# EAGLE design TZATZIKI_v8 (EAGLE 7.6.0)
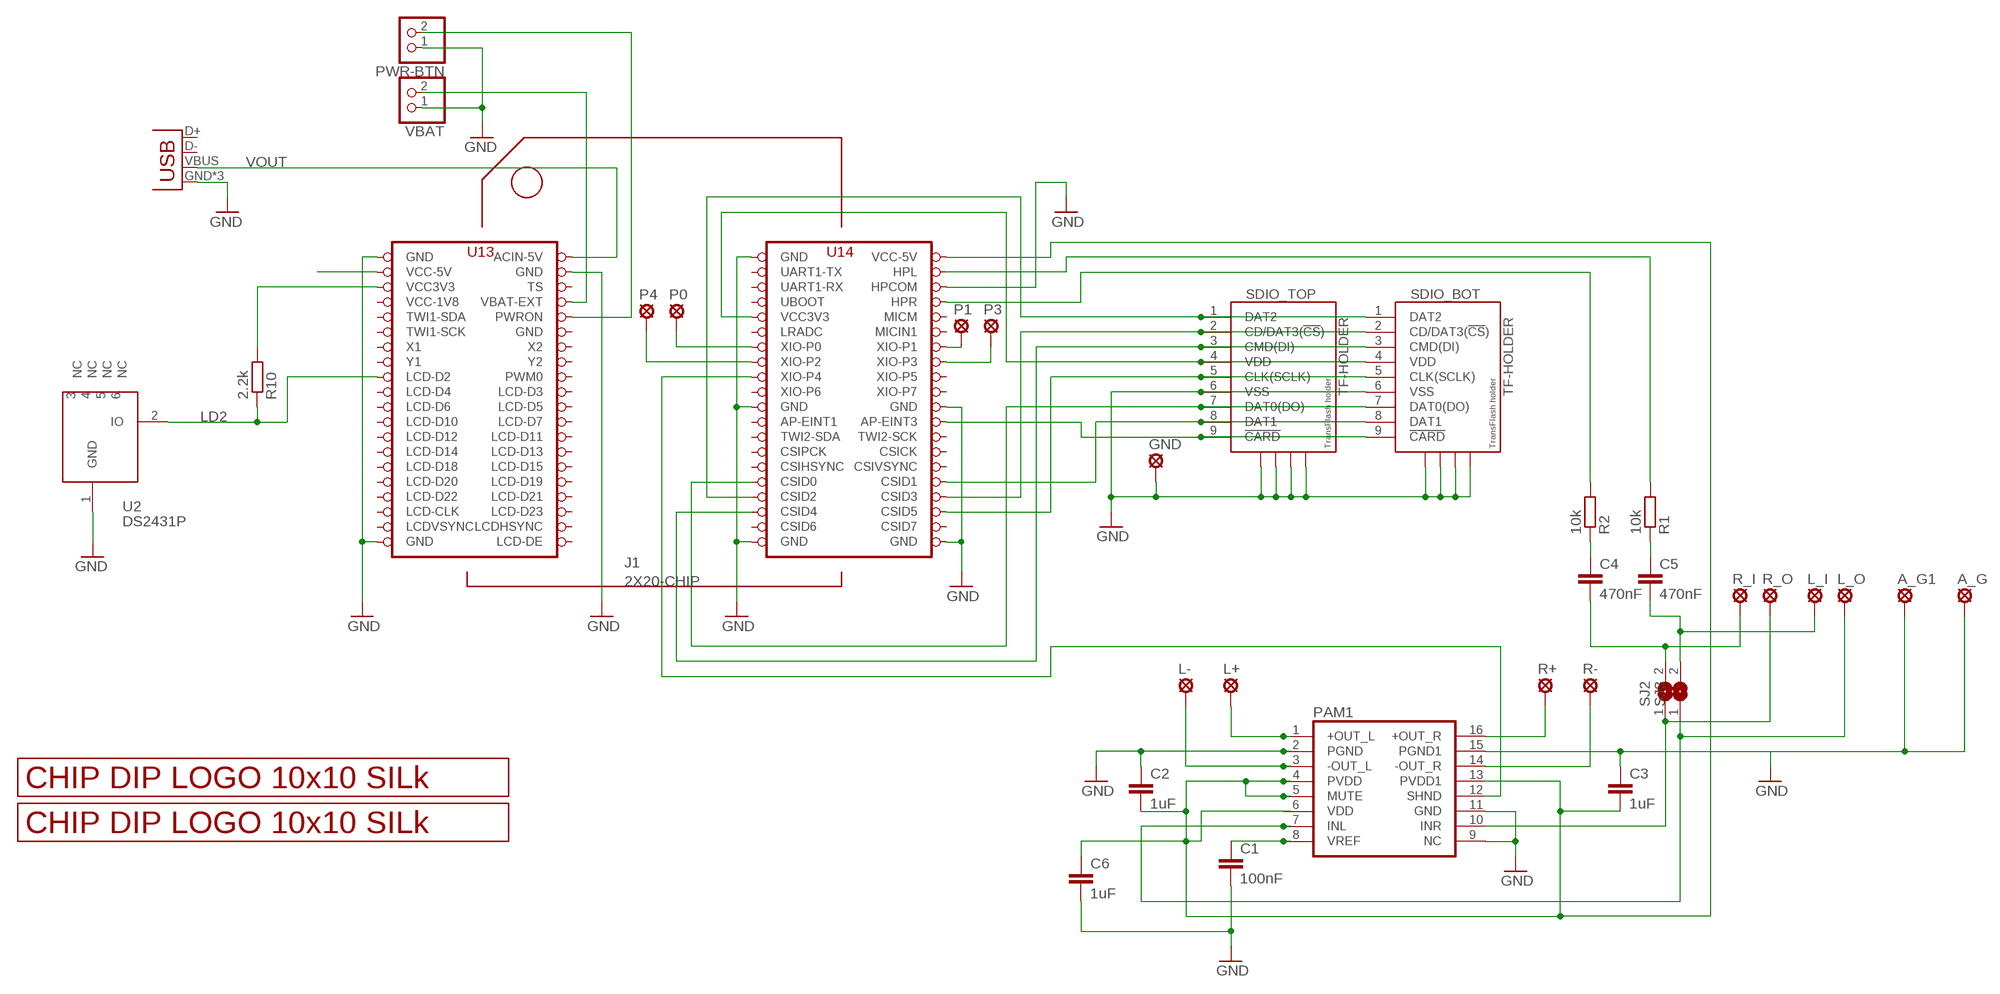
[diagram p0: schematic, sheet 1]

## Parts
A_G  SE11  [SE11]
A_G1  SE11  [SE11]
C1  100nF  C-EUC0805  [C0805]
C2  1uF  C-EUC0805  [C0805]
C3  1uF  C-EUC0805  [C0805]
C4  470nF  C-EUC0805  [C0805]
C5  470nF  C-EUC0805  [C0805]
C6  1uF  C-EUC0805  [C0805]
GND  SE11  [SE11]
J1  2X20-CHIP  [2X20CHIP_OFFSET-TH]
L+  SE11  [SE11]
L-  SE11  [SE11]
L_I  SE11  [SE11]
L_O  SE11  [SE11]
P0  SE11  [SE11]
P1  SE11  [SE11]
P3  SE11  [SE11]
P4  SE11  [SE11]
PAM1  PAM8403  [SOP-16]
POWER_USB  USBUSB-MICROB-SMT-DIP  [USB-MICROB-SMT-DIP]
PWR-BTN  PINHD-1X2  [1X02]
R1  10k  R-EU_R0805  [R0805]
R2  10k  R-EU_R0805  [R0805]
R10  2.2k  R-EU_R0805  [R0805]
R+  SE11  [SE11]
R-  SE11  [SE11]
R_I  SE11  [SE11]
R_O  SE11  [SE11]
SDIO_BOT  TF-HOLDER  [TF-PULL]
SDIO_TOP  TF-HOLDER  [TF-PULL]
SJ2  SJ  [SJ]
SJ3  SJ  [SJ]
U2  DS2431P  [TSOC6]
U$1  LOGO_10X10_SILK  [LOGO2_10X10_SILK]
U$2  LOGO_10X10_SILK  [LOGO2_10X10_SILK]
VBAT  PINHD-1X2  [1X02]

## Nets
GND: A_G1.MP A_G.MP C1.2 C2.1 C3.1 C6.2 GND.MP J1.GND@1(GND) J1.GND@2(GND) J1.GND@4(GND) J1.GND@5(GND) J1.GND@6(GND) J1.GND@7(GND) J1.GND@8(GND) J1.GND@10(GND) J1.HPCOM PAM1.2(PGND) PAM1.9(NC) PAM1.11(GND) PAM1.15(PGND1) POWER_USB.GND POWER_USB.MT1(GND) POWER_USB.MT2(GND) PWR-BTN.1 SDIO_BOT.6(VSS) SDIO_BOT.S1 SDIO_BOT.S2 SDIO_BOT.S3 SDIO_BOT.S4 SDIO_TOP.6(VSS) SDIO_TOP.S1 SDIO_TOP.S2 SDIO_TOP.S3 SDIO_TOP.S4 U2.1(GND) VBAT.1
LD2: J1.LCD-D2 R10.1 U2.2(IO)
N$1: J1.VCC3V3 R10.2
N$2: J1.CSID3 SDIO_BOT.2(CD/DAT3(!CS!)) SDIO_TOP.2(CD/DAT3(!CS!))
N$3: J1.CSID0 SDIO_BOT.7(DAT0(DO)) SDIO_TOP.7(DAT0(DO))
N$4: J1.CSID4 SDIO_BOT.3(CMD(DI)) SDIO_TOP.3(CMD(DI))
N$5: J1.CSID5 SDIO_BOT.5(CLK(SCLK)) SDIO_TOP.5(CLK(SCLK))
N$6: J1.CSID1 SDIO_BOT.8(DAT1) SDIO_TOP.8(DAT1)
N$7: C2.2 C3.2 C6.1 J1.VCC5V@1(VCC-5V) PAM1.4(PVDD) PAM1.5(MUTE) PAM1.6(VDD) PAM1.13(PVDD1)
N$8: J1.VCC5V@0(VCC-5V)
N$9: J1.CSID2 SDIO_BOT.1(DAT2) SDIO_TOP.1(DAT2)
N$10: J1.VCC3V3@1(VCC3V3) SDIO_BOT.4(VDD) SDIO_TOP.4(VDD)
N$11: L+.MP PAM1.1(+OUT_L)
N$12: L-.MP PAM1.3(-OUT_L)
N$13: PAM1.16(+OUT_R) R+.MP
N$14: PAM1.14(-OUT_R) R-.MP
N$15: L_O.MP PAM1.7(INL) SJ3.1
N$16: J1.AP-EINT3 SDIO_BOT.9(!CARD) SDIO_TOP.9(!CARD)
N$18: PAM1.10(INR) R_O.MP SJ2.1
N$19: J1.HPL R1.2
N$20: C1.1 PAM1.8(VREF)
N$21: C4.1 R2.1
N$22: C5.1 R1.1
N$23: J1.XIO-P1 P1.MP
N$24: J1.XIO-P3 P3.MP
N$25: J1.XIO-P0 P0.MP
N$26: J1.XIO-P2 P4.MP
N$27: J1.XIO-P4 PAM1.12(SHND)
N$28: J1.BAT(VBAT-EXT) VBAT.2
N$29: J1.PWRON PWR-BTN.2
N$30: J1.HPR R2.2
N$31: C4.2 R_I.MP SJ2.2
N$32: C5.2 L_I.MP SJ3.2
VOUT: J1.CHG-IN(ACIN-5V) POWER_USB.VBUS
Unconnected: J1.AP-EINT1 J1.CSICK J1.CSID6 J1.CSID7 J1.CSIHSYNC J1.CSIPCK J1.CSIVSYNC J1.FEL(UBOOT) J1.LCD-CLK J1.LCD-D3 J1.LCD-D4 J1.LCD-D5 J1.LCD-D6 J1.LCD-D7 J1.LCD-D10 J1.LCD-D11 J1.LCD-D12 J1.LCD-D13 J1.LCD-D14 J1.LCD-D15 J1.LCD-D18 J1.LCD-D19 J1.LCD-D20 J1.LCD-D21 J1.LCD-D22 J1.LCD-D23 J1.LCD-DE J1.LCD-HSYNC(LCDHSYNC) J1.LCD-VSYNC(LCDVSYNC) J1.LRADC J1.MICIN1 J1.MICM J1.PWM0 J1.TS J1.TWI1-SCK J1.TWI1-SDA J1.TWI2-SCK J1.TWI2-SDA J1.UART1-RX J1.UART1-TX J1.X1 J1.X2 J1.XIO-P5 J1.XIO-P6 J1.XIO-P7 J1.Y1 J1.Y2 POWER_USB.D+ POWER_USB.D- U2.3(NC) U2.4(NC) U2.5(NC) U2.6(NC)

## Power pins joined to a net without a drawn wire
GND: J1.GND@3(GND)
VCC-1V8: J1.VCC1V8(VCC-1V8)

## Library data of the parts
A_G A_G1 GND L+ L- L_I L_O P0 P1 P3 P4 R+ R- R_I R_O = solpad:SE11: SOLDER PAD RTM, drill 1,1mm, distributor Buerklin, 07F810
C1-C6 = rcl:C-EU: CAPACITOR, European symbol
J1 = JKW_CHIP:2X20-CHIP: Through hole layout with chip reference
PAM1 = JKW_CHIP:PAM8403: Dual channel audio amplifier IC - PAM8403
POWER_USB = Spark:USB
PWR-BTN VBAT = pinhead:PINHD-1X2: PIN HEADER
R1 R2 R10 = rcl:R-EU_: RESISTOR, European symbol
SDIO_BOT SDIO_TOP = JKW_CHIP:TF-HOLDER: TF / Micro SD socket is PUSH-PUSH type, the card can be pushed into and auto locked and pushed out by simply press the card. Surface Mounting type.
SJ2 SJ3 = jumper:SJ: SMD solder JUMPER
U2 = JKW_CHIP:DS2431: 1024-Bit EEPROM This chip provides a 4x256 Bit EEPROM, which can be programmed@5V. Write protection and OTP emulation are available, too. Author: Jan Kandziora <jjj@gmx.de>; DESCRIPTION: IC, 1024-Bit, 1-Wire EEPROM, TSOC6; FOOTPRINT: TSOC6; LINK: http://www.digikey.com/product-detail/en/DS2431P%2BT%26R/DS2431P%2BT%26RCT-ND/3647900; MFG: DIGIKEY; MFG_PN: DS2431P+T&RCT-ND; PART_TYPE: IC; PRICE: 0.98; VENDOR: MAXIM; VENDOR_PART_NUMBER: DS2431P+T&R
U$1 U$2 = JKW_CHIP:LOGO_10X10_SILK

## Board
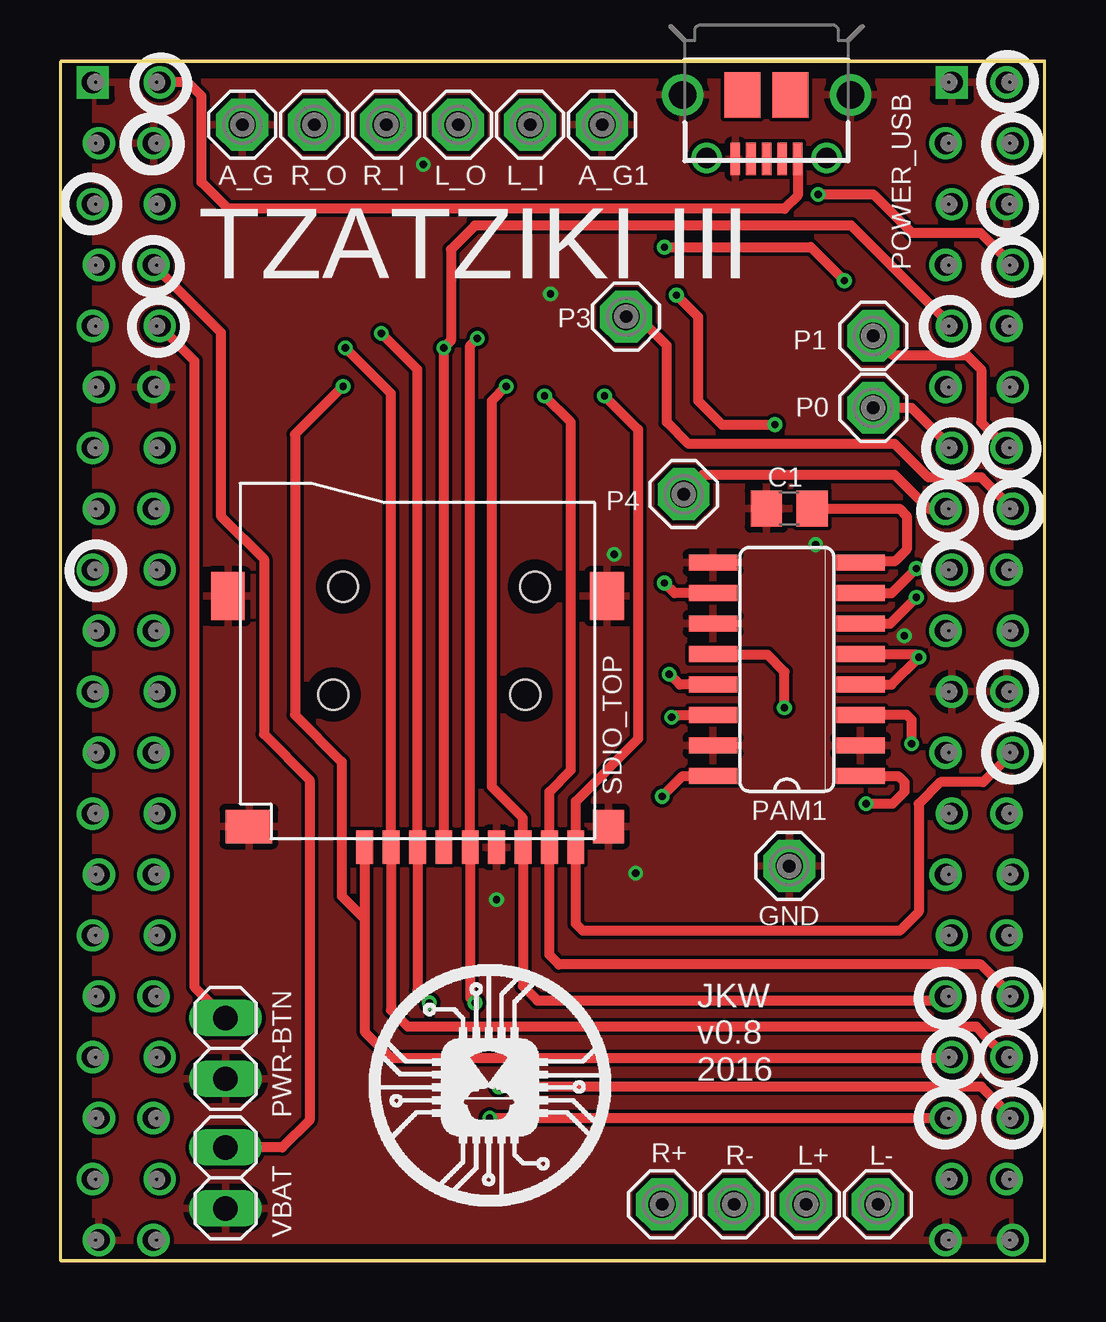
[diagram p1: board, top side]
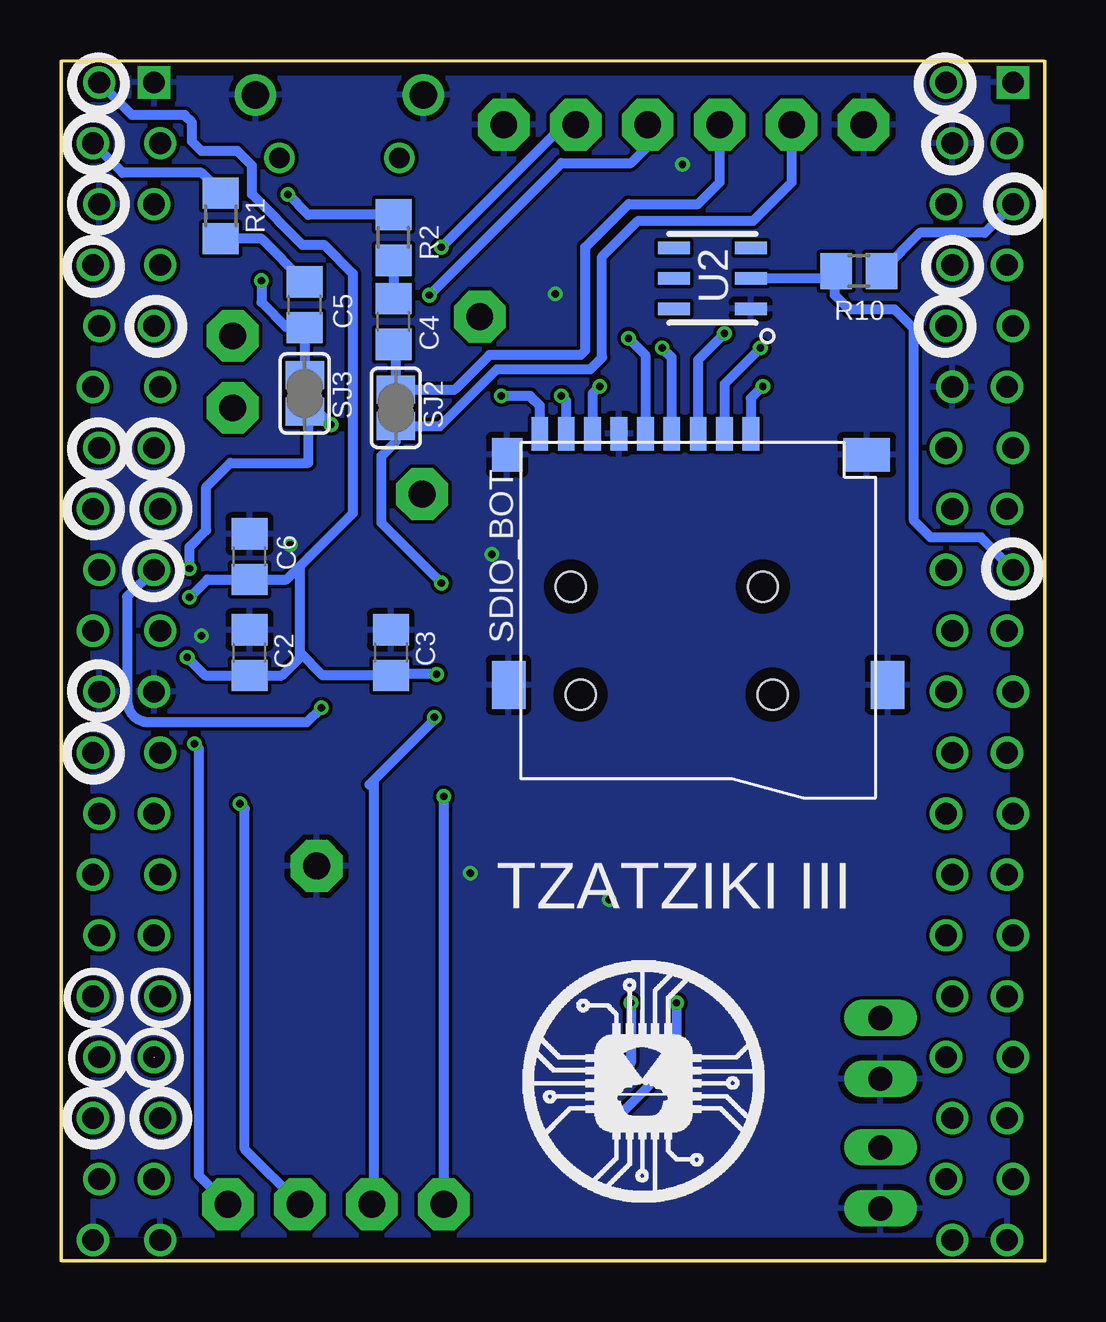
[diagram p2: board, bottom side, seen from below]

Size 41.1 x 50.1 mm. Coordinates in mm from the lower left corner, seen from the top.
Outline: 0,0.1 41,0.1 41,2
Outline: 0,0 41.1,0 41.1,50.1 0,50.1 0,0
Copper layers (1*16): Top 0.035mm / dielectric 1.6mm / Bottom 0.035mm
Design rules "Elecrow_2-layer_PCB_eagle_rule": minimum track width 6mil, minimum drill 12mil, track to track 6mil, track to pad 6mil, pad to pad 6mil, via to via 8mil, smd to smd 0mil, copper to edge 20mil, drill to drill 10mil, minimum pad ring 6mil, minimum via ring 6mil, stop-mask expansion 0mil, vias tented up to drill 100mil, thermal gap 10mil

### Footprints (pad centres in the part's own frame; a part is rotated, then mirrored left to right if it is on the bottom)
SE11 = drill 1.118 pad 2.159 octagon: MP 0,0
C0805 = smd 1.3 x 1.5: 1 -0.95,0; 2 0.95,0
2X20CHIP_OFFSET-TH = drill 0.9: AP-EINT1 15.113,-3.81; AP-EINT3 17.907,-3.81; BAT -17.907,16.51; CHG-IN -17.653,24.13; CSICK 17.907,-8.89; CSID0 15.113,-13.97; CSID1 17.907,-13.97; CSID2 15.367,-16.51; CSID3 17.653,-16.51; CSID4 15.113,-19.05; CSID5 17.907,-19.05; CSID6 15.367,-21.59; CSID7 17.653,-21.59; CSIHSYNC 15.367,-11.43; CSIPCK 15.113,-8.89; CSIVSYNC 17.653,-11.43; FEL 15.113,16.51; GND@1 -17.907,11.43; GND@2 -20.193,-24.13; GND@4 17.653,-1.27; GND@5 17.907,-24.13; GND@6 15.113,-24.13; GND@7 15.367,-1.27; GND@10 -17.907,21.59; HPCOM 17.653,19.05; HPL 17.907,21.59; HPR 17.907,16.51; LCD-CLK -20.193,-19.05; LCD-D2 -20.447,3.81; LCD-D3 -17.907,1.27; LCD-D4 -20.193,1.27; LCD-D5 -17.653,-1.27; LCD-D6 -20.447,-1.27; LCD-D7 -17.907,-3.81; LCD-D10 -20.193,-3.81; LCD-D11 -17.653,-6.35; LCD-D12 -20.447,-6.35; LCD-D13 -17.907,-8.89; LCD-D14 -20.193,-8.89; LCD-D15 -17.653,-11.43; LCD-D18 -20.447,-11.43; LCD-D19 -17.907,-13.97; LCD-D20 -20.193,-13.97; LCD-D21 -17.653,-16.51; LCD-D22 -20.447,-16.51; LCD-D23 -17.907,-19.05; LCD-DE -17.907,-24.13; LCD-HSYNC -17.653,-21.59; LCD-VSYNC -20.447,-21.59; LRADC 15.113,11.43; MICIN1 17.907,11.43; MICM 17.653,13.97; PWM0 -17.653,3.81; PWRON -17.653,13.97; TS -17.653,19.05; TWI1-SCK -20.193,11.43; TWI1-SDA -20.447,13.97; TWI2-SCK 17.653,-6.35; TWI2-SDA 15.367,-6.35; UART1-RX 15.367,19.05; UART1-TX 15.113,21.59; VCC1V8 -20.193,16.51; VCC3V3 -20.447,19.05; VCC3V3@1 15.367,13.97; VCC5V@0 -20.193,21.59; VCC5V@1 17.653,24.13; X1 -20.447,8.89; X2 -17.653,8.89; XIO-P0 15.367,8.89; XIO-P1 17.653,8.89; XIO-P2 15.113,6.35; XIO-P3 17.907,6.35; XIO-P4 15.367,3.81; XIO-P5 17.653,3.81; XIO-P6 15.113,1.27; XIO-P7 17.907,1.27; Y1 -20.193,6.35; Y2 -17.907,6.35 | drill 0.9 square: GND@3 -20.447,24.13; GND@8 15.367,24.13
SOP-16 = smd 0.66 x 2.032: 1 -4.445,-3.073; 2 -3.175,-3.073; 3 -1.905,-3.073; 4 -0.635,-3.073; 5 0.635,-3.073; 6 1.905,-3.073; 7 3.175,-3.073; 8 4.445,-3.073; 9 4.445,3.073; 10 3.175,3.073; 11 1.905,3.073; 12 0.635,3.073; 13 -0.635,3.073; 14 -1.905,3.073; 15 -3.175,3.073; 16 -4.445,3.073
USB-MICROB-SMT-DIP = smd 0.4 x 1.35: D+ 0,2.675; D- -0.65,2.675; GND 1.3,2.675; ID 0.65,2.675; VBUS -1.3,2.675 | drill 1.15 pad 1.7: MT1 -3.5,0; MT2 3.5,0 | drill 0.85 pad 1.25: MT3 -2.5,2.625; MT4 2.5,2.625 | smd 1.5 x 1.9: P$1 -1,0; P$2 1,0.01
1X02 = drill 1.016 long: 1 -1.27,0; 2 1.27,0
R0805 = smd 1.3 x 1.5: 1 -0.95,0; 2 0.95,0
TF-PULL = smd 0.7 x 1.4: 1 -2.2,-7.62; 2 -1.1,-7.62; 3 0,-7.62; 4 1.1,-7.62; 5 2.2,-7.62; 6 3.3,-7.62; 7 4.4,-7.62; 8 5.5,-7.62; 9 6.6,-7.62 | smd 1.4 x 2: S1 -7.9,2.85; S2 7.9,2.85 | smd 1.28 x 1.4: S3 7.96,-6.75 | smd 1.95 x 1.4: S4 -7.025,-6.75 | hole 1.25: -3.1,3.25; 4.9,3.25
SJ = smd 1.168 x 1.6: 1 -0.762,0; 2 0.762,0
TSOC6 = smd 0.53 x 1.33: 1 -1.27,-1.6; 2 0,-1.6; 3 1.27,-1.6; 4 1.27,1.6; 5 0,1.6; 6 -1.27,1.6

### Placement (x,y rotation side)
A_G  7.6,47.4 180 top
A_G1  22.6,47.4 0 top
C1  30.4,31.4 180 top
C2  33.2,25.4 270 bottom
C3  27.3,25.4 270 bottom
C4  27.2,39.2 270 bottom
C5  30.9,39.9 270 bottom
C6  33.2,29.4 90 bottom
GND  30.4,16.5 180 top
J1  21.81,25.04 0 top
L+  31.1,2.4 0 top
L-  34.1,2.4 0 top
L_I  19.6,47.4 180 top
L_O  16.6,47.4 180 top
P0  33.9,35.6 180 top
P1  33.9,38.6 0 top
P3  23.6,39.4 180 top
P4  26,32 180 top
PAM1  30.3,24.7 90 top
POWER_USB  29.45,48.65 180 top
PWR-BTN  6.9,8.9 90 top
R1  34.4,43.6 90 bottom
R2  27.2,42.7 90 bottom
R10  7.8,41.3 0 bottom
R+  25.1,2.4 0 top
R-  28.1,2.4 0 top
R_I  13.6,47.4 180 top
R_O  10.6,47.4 180 top
SDIO_BOT  14.5,26.9 180 bottom
SDIO_TOP  14.9,24.9 0 top
SJ2  27.1,35.6 90 bottom
SJ3  30.9,36.2 90 bottom
U2  13.9,41 90 bottom
U$1  12.9,2.33 0 top
U$2  21.8,2.5 0 bottom
VBAT  6.9,3.5 90 top

### Tracks (layer width: path | path; a pad name or v marks a point on that pad's centre or on a via)
GND  (via drill 0.3)
  other vias: 20.45,40.35 24,16.2 18.2,15.1 23.1,29.5 35.2,26.1 15.15,45.75 31.5,29.9
  pour Top (isolate 0.152): 1.49,0.91 39.59,0.91 39.59,49.17 1.49,49.17
  pour Bottom (isolate 0.152): 39.71,1.16 1.61,1.16 1.61,49.42 39.71,49.42
LD2
  Bottom 0.406: U2.2 9.05,41 R10.1 8.8,41.25 8.8,40.3 8.2,39.7 6.3,39.7 5.5,38.9 5.5,30.9 4.8,30.2 2.71,30.2 J1.LCD-D2
N$1
  Bottom 0.406: R10.2 5.25,42.9 2.55,42.9 J1.VCC3V3
N$2  (via drill 0.3)
  Top 0.406: v11.9,38.1 13.8,36.2 SDIO_TOP.2 13.8,10.5 14.5,9.8 38.2,9.8 38.39,9.61 38.39,9.6 J1.CSID3
  Bottom 0.406: v11.9,38.1 13.4,36.6 SDIO_BOT.2
N$3  (via drill 0.3)
  Top 0.406: v18.6,36.5 18,35.9 18,19.8 19.3,18.5 SDIO_TOP.7 19.3,11.5 19.9,10.9 36.75,10.9 J1.CSID0
  Bottom 0.406: v18.6,36.5 18.9,36.2 SDIO_BOT.7
N$4  (via drill 0.3)
  Top 0.406: v15.4,10.8 14.9,11.3 SDIO_TOP.3 14.9,37.2 v13.4,38.7 | J1.CSID4 v17.91,5.99
  Bottom 0.406: v15.4,10.8 15.4,8.5 v17.91,5.99 | v13.4,38.7 14.5,37.6 SDIO_BOT.3
N$5  (via drill 0.3)
  Top 0.406: v17.3,10.8 17.1,11 SDIO_TOP.5 17.1,38.2 v17.4,38.5 | v18.3,7.3 38.41,7.3 J1.CSID5
  Bottom 0.406: v17.3,10.8 17.3,8.3 v18.3,7.3 | v17.4,38.5 16.7,37.8 SDIO_BOT.5
N$6  (via drill 0.3)
  Top 0.406: J1.CSID1 38.39,12.4 20.8,12.4 20.4,12.8 SDIO_TOP.8 20.4,19.6 21.3,20.5 21.3,35 v20.2,36.1
  Bottom 0.406: v20.2,36.1 20,35.9 SDIO_BOT.8
N$7  (via drill 0.3)
  Top 0.406: PAM1.4 34.66,24.06 v35.8,25.2 35.66,25.34 PAM1.5 | PAM1.13 25.84,24.06 v25.4,24.5 | PAM1.6 34.61,26.6 v35.7,27.7
  Bottom 0.406: v35.8,25.2 35.05,24.45 C2.2 | C2.2 31.85,24.45 31.1,25.2 31.1,25.4 | v25.4,24.5 27.25,24.5 C3.2 30.15,24.45 31.1,25.4 | 31.1,29 31.65,28.45 C6.1 34.95,28.45 v35.7,27.7 | 31.1,25.4 31.1,29 | 31.1,29 28.9,31.2 28.9,41.2 30.1,42.4 31,42.4 33.1,44.5 33.1,45.7 33.7,46.3 35.2,46.3 35.6,46.7 35.6,47.5 35.9,47.8 38.09,47.8 J1.VCC5V@1 | C2.2 33.37,24.28 PAM1.4
N$9  (via drill 0.3)  (1 unrouted)
  Top 0.406: SDIO_TOP.1 12.7,14.3 | 12.7,14.3 12.7,9.6 13.8,8.5 37.15,8.5 | v11.8,36.5 9.8,34.5 9.8,22.8 11.75,20.85 11.75,15.25 12.7,14.3
  Bottom 0.406: v11.8,36.5 12.3,36 SDIO_BOT.1
N$10  (via drill 0.3)
  Top 0.406: SDIO_TOP.4 v16,38.1 16.3,38.4 16.3,42.2 17.3,43.2 32.99,43.2 J1.VCC3V3@1
  Bottom 0.406: SDIO_BOT.4 15.6,37.7 v16,38.1
N$11  (via drill 0.3)
  Top 0.406: PAM1.1 34.95,20.25 35.2,20 35.2,19.6 34.7,19.1 v33.6,19.1
  Bottom 0.406: v33.6,19.1 33.4,18.9 33.4,4.7 L+.MP
N$12  (via drill 0.3)
  Top 0.406: v35.5,21.6 35.5,22.6 35.3,22.8 PAM1.3
  Bottom 0.406: L-.MP 35.3,3.6 35.3,21.4 v35.5,21.6
N$13  (via drill 0.3)
  Top 0.406: v25.1,19.4 25.95,20.25 PAM1.16
  Bottom 0.406: R+.MP v25.1,19.4
N$14  (via drill 0.3)
  Top 0.406: v25.5,22.7 25.59,22.8 PAM1.14
  Bottom 0.406: 28.2,19.9 28,20.1 | 28,20.1 25.5,22.6 v25.5,22.7 | 28,20.1 28,2.5 R-.MP
N$15  (via drill 0.3)
  Top 0.406: PAM1.7 34.68,27.88 v35.7,28.9 | v25.7,40.3 26.6,39.4 26.6,35.9 27.6,34.9 v29.8,34.9
  Bottom 0.406: v35.7,28.9 35.7,29.8 35,30.5 35,32.3 34,33.3 30.75,33.3 30.75,35.29 SJ3.1 | 31.24,35.1 SJ3.1 | v25.7,40.3 20.2,45.8 17.3,45.8 16.6,46.5 L_O.MP | v29.8,34.9 30.34,35.44 SJ3.1
N$16  (via drill 0.3)
  Top 0.406: v22.7,36.1 24.1,34.7 24.1,21.8 21.5,19.2 SDIO_TOP.9 21.5,14.1 21.8,13.8 35,13.8 35.8,14.6 35.8,19.1 36.7,20 38.49,20 J1.AP-EINT3
  Bottom 0.406: SDIO_BOT.9 21.1,35.7 21.5,36.1 v22.7,36.1
N$18  (via drill 0.3)
  Top 0.406: PAM1.10 25.62,27.88 v25.2,28.3
  Bottom 0.406: v25.2,28.3 27.7,30.8 27.7,33.6 27.1,34.2 SJ2.1 25.26,34.84 22.9,37.2 19,37.2 18.5,37.7 18.5,41.9 17,43.4 12.2,43.4 10.6,45 R_O.MP
N$19
  Bottom 0.406: J1.HPL 38.49,45.4 35.2,45.4 34.4,44.6 R1.2
N$20
  Top 0.406: C1.1 35,31.4 35.3,31.1 35.3,29.7 34.8,29.2 33.43,29.2 PAM1.8
N$21
  Bottom 0.406: R2.1 C4.1
N$22
  Bottom 0.406: C5.1 32.7,42.65 R1.1
N$23
  Top 0.406: J1.XIO-P1 38.4,34.99 38.4,37.2 37.8,37.8 34.7,37.8 P1.MP
N$24
  Top 0.406: J1.XIO-P3 38.41,32.7 36.2,32.7 34.8,34.1 26.2,34.1 25.3,35 25.3,38.2 24.1,39.4 P3.MP
N$25
  Top 0.406: J1.XIO-P0 35.51,35.6 P0.MP
N$26
  Top 0.406: J1.XIO-P2 36.21,31.39 34.8,32.8 26.8,32.8 P4.MP
N$27  (via drill 0.3)
  Top 0.406: v30.2,23.1 30.2,24.6 29.5,25.3 27.26,25.3 PAM1.12
  Bottom 0.406: v30.2,23.1 30.8,22.5 37.4,22.5 arc90 38.3,23.4 38.3,27.73 J1.XIO-P4
N$28
  Top 0.406: VBAT.2 9.27,4.77 10.4,5.9 10.4,20.1 8.5,22 8.5,29.3 6.7,31.1 6.7,38.75 J1.BAT
N$29
  Top 0.406: PWR-BTN.2 5.6,11.47 5.6,37.57 J1.PWRON
N$30  (via drill 0.3)
  Top 0.406: J1.HPR 38.37,42.9 35.5,42.9 33.9,44.5 v31.6,44.5
  Bottom 0.406: R2.2 30.75,43.65 v31.6,44.5
N$31
  Bottom 0.406: SJ2.2 27.1,38.15 C4.2 | SJ2.2 24.64,36.36 23.2,37.8 19.4,37.8 19.2,38 19.2,42.3 17.4,44.1 14.5,44.1 13.6,45 R_I.MP | SJ2.2 27.1,35.1
N$32  (via drill 0.3)
  Top 0.406: v25.2,42.3 31.3,42.3 v32.7,40.9
  Bottom 0.406: v32.7,40.9 32.7,40 31.65,38.95 C5.2 SJ3.2 30.9,35.5 | v25.2,42.3 20.1,47.4 L_I.MP
VOUT
  Top 0.406: J1.CHG-IN 5.33,49.17 5.9,48.6 5.9,45 7,43.9 30.2,43.9 30.75,44.45 POWER_USB.VBUS

### Text on the board
Unrouted: Not Ordered
tNames: TZATZIKI III | JKW / v0.8 / 2016
bNames: TZATZIKI III